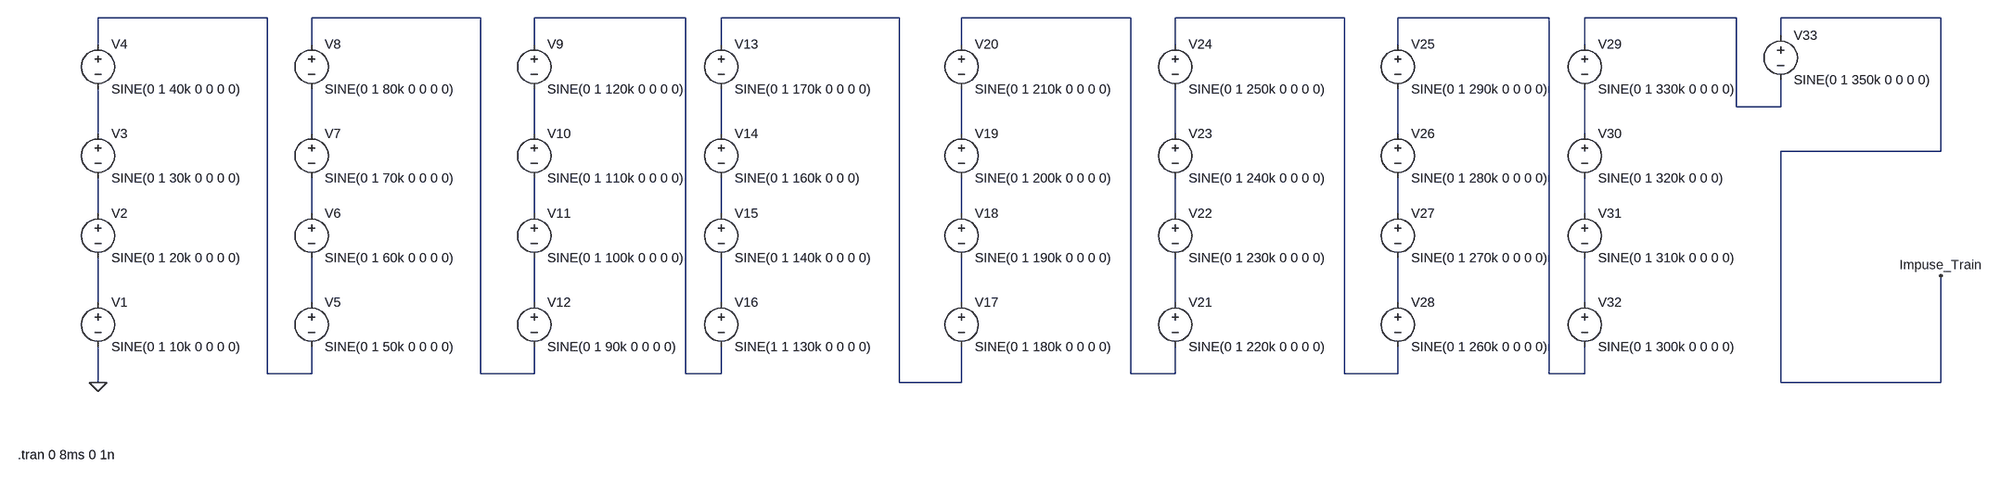
[diagram p0: schematic impuseIsgnals.asc]
impuseIsgnals.asc, the LTspice schematic file:
Version 4
SHEET 1 1928 680
WIRE -1184 -336 -1488 -336
WIRE -800 -336 -1104 -336
WIRE -432 -336 -704 -336
WIRE -48 -336 -368 -336
WIRE 368 -336 64 -336
WIRE 752 -336 448 -336
WIRE 1120 -336 848 -336
WIRE 1456 -336 1184 -336
WIRE 1824 -336 1536 -336
WIRE 1536 -304 1536 -336
WIRE -1488 -288 -1488 -336
WIRE -1104 -288 -1104 -336
WIRE -704 -288 -704 -336
WIRE -368 -288 -368 -336
WIRE 64 -288 64 -336
WIRE 448 -288 448 -336
WIRE 848 -288 848 -336
WIRE 1184 -288 1184 -336
WIRE 1456 -176 1456 -336
WIRE 1536 -176 1536 -224
WIRE 1536 -176 1456 -176
WIRE -1488 -128 -1488 -208
WIRE -1104 -128 -1104 -208
WIRE -704 -128 -704 -208
WIRE -368 -128 -368 -208
WIRE 64 -128 64 -208
WIRE 448 -128 448 -208
WIRE 848 -128 848 -208
WIRE 1184 -128 1184 -208
WIRE 1824 -96 1824 -336
WIRE 1824 -96 1536 -96
WIRE -1488 16 -1488 -48
WIRE -1104 16 -1104 -48
WIRE -704 16 -704 -48
WIRE -368 16 -368 -48
WIRE 64 16 64 -48
WIRE 448 16 448 -48
WIRE 848 16 848 -48
WIRE 1184 16 1184 -48
WIRE -1488 176 -1488 96
WIRE -1104 176 -1104 96
WIRE -704 176 -704 96
WIRE -368 176 -368 96
WIRE 64 176 64 96
WIRE 448 176 448 96
WIRE 848 176 848 96
WIRE 1184 176 1184 96
WIRE -1184 304 -1184 -336
WIRE -1104 304 -1104 256
WIRE -1104 304 -1184 304
WIRE -800 304 -800 -336
WIRE -704 304 -704 256
WIRE -704 304 -800 304
WIRE -432 304 -432 -336
WIRE -368 304 -368 256
WIRE -368 304 -432 304
WIRE 368 304 368 -336
WIRE 448 304 448 256
WIRE 448 304 368 304
WIRE 752 304 752 -336
WIRE 848 304 848 256
WIRE 848 304 752 304
WIRE 1120 304 1120 -336
WIRE 1184 304 1184 256
WIRE 1184 304 1120 304
WIRE -1488 320 -1488 256
WIRE -48 320 -48 -336
WIRE 64 320 64 256
WIRE 64 320 -48 320
WIRE 1536 320 1536 -96
WIRE 1824 320 1824 128
WIRE 1824 320 1536 320
FLAG -1488 320 0
FLAG 1824 128 Impuse_Train
SYMBOL voltage -1488 160 R0
WINDOW 123 0 0 Left 2
WINDOW 39 0 0 Left 2
SYMATTR InstName V1
SYMATTR Value SINE(0 1 10k 0 0 0 0)
SYMBOL voltage -1488 0 R0
WINDOW 123 0 0 Left 2
WINDOW 39 0 0 Left 2
SYMATTR InstName V2
SYMATTR Value SINE(0 1 20k 0 0 0 0)
SYMBOL voltage -1488 -144 R0
WINDOW 123 0 0 Left 2
WINDOW 39 0 0 Left 2
SYMATTR InstName V3
SYMATTR Value SINE(0 1 30k 0 0 0 0)
SYMBOL voltage -1488 -304 R0
WINDOW 123 0 0 Left 2
WINDOW 39 0 0 Left 2
SYMATTR InstName V4
SYMATTR Value SINE(0 1 40k 0 0 0 0)
SYMBOL voltage -1104 160 R0
WINDOW 123 0 0 Left 2
WINDOW 39 0 0 Left 2
SYMATTR InstName V5
SYMATTR Value SINE(0 1 50k 0 0 0 0)
SYMBOL voltage -1104 0 R0
WINDOW 123 0 0 Left 2
WINDOW 39 0 0 Left 2
SYMATTR InstName V6
SYMATTR Value SINE(0 1 60k 0 0 0 0)
SYMBOL voltage -1104 -144 R0
WINDOW 123 0 0 Left 2
WINDOW 39 0 0 Left 2
SYMATTR InstName V7
SYMATTR Value SINE(0 1 70k 0 0 0 0)
SYMBOL voltage -1104 -304 R0
WINDOW 123 0 0 Left 2
WINDOW 39 0 0 Left 2
SYMATTR InstName V8
SYMATTR Value SINE(0 1 80k 0 0 0 0)
SYMBOL voltage -704 -304 R0
WINDOW 123 0 0 Left 2
WINDOW 39 0 0 Left 2
SYMATTR InstName V9
SYMATTR Value SINE(0 1 120k 0 0 0 0)
SYMBOL voltage -704 -144 R0
WINDOW 123 0 0 Left 2
WINDOW 39 0 0 Left 2
SYMATTR InstName V10
SYMATTR Value SINE(0 1 110k 0 0 0 0)
SYMBOL voltage -704 0 R0
WINDOW 123 0 0 Left 2
WINDOW 39 0 0 Left 2
SYMATTR InstName V11
SYMATTR Value SINE(0 1 100k 0 0 0 0)
SYMBOL voltage -704 160 R0
WINDOW 123 0 0 Left 2
WINDOW 39 0 0 Left 2
SYMATTR InstName V12
SYMATTR Value SINE(0 1 90k 0 0 0 0)
SYMBOL voltage -368 -304 R0
WINDOW 123 0 0 Left 2
WINDOW 39 0 0 Left 2
SYMATTR InstName V13
SYMATTR Value SINE(0 1 170k 0 0 0 0)
SYMBOL voltage -368 -144 R0
WINDOW 123 0 0 Left 2
WINDOW 39 0 0 Left 2
SYMATTR InstName V14
SYMATTR Value SINE(0 1 160k 0 0 0)
SYMBOL voltage -368 0 R0
WINDOW 123 0 0 Left 2
WINDOW 39 0 0 Left 2
SYMATTR InstName V15
SYMATTR Value SINE(0 1 140k 0 0 0 0)
SYMBOL voltage -368 160 R0
WINDOW 123 0 0 Left 2
WINDOW 39 0 0 Left 2
SYMATTR InstName V16
SYMATTR Value SINE(1 1 130k 0 0 0 0)
SYMBOL voltage 64 160 R0
WINDOW 123 0 0 Left 2
WINDOW 39 0 0 Left 2
SYMATTR InstName V17
SYMATTR Value SINE(0 1 180k 0 0 0 0)
SYMBOL voltage 64 0 R0
WINDOW 123 0 0 Left 2
WINDOW 39 0 0 Left 2
SYMATTR InstName V18
SYMATTR Value SINE(0 1 190k 0 0 0 0)
SYMBOL voltage 64 -144 R0
WINDOW 123 0 0 Left 2
WINDOW 39 0 0 Left 2
SYMATTR InstName V19
SYMATTR Value SINE(0 1 200k 0 0 0 0)
SYMBOL voltage 64 -304 R0
WINDOW 123 0 0 Left 2
WINDOW 39 0 0 Left 2
SYMATTR InstName V20
SYMATTR Value SINE(0 1 210k 0 0 0 0)
SYMBOL voltage 448 160 R0
WINDOW 123 0 0 Left 2
WINDOW 39 0 0 Left 2
SYMATTR InstName V21
SYMATTR Value SINE(0 1 220k 0 0 0 0)
SYMBOL voltage 448 0 R0
WINDOW 123 0 0 Left 2
WINDOW 39 0 0 Left 2
SYMATTR InstName V22
SYMATTR Value SINE(0 1 230k 0 0 0 0)
SYMBOL voltage 448 -144 R0
WINDOW 123 0 0 Left 2
WINDOW 39 0 0 Left 2
SYMATTR InstName V23
SYMATTR Value SINE(0 1 240k 0 0 0 0)
SYMBOL voltage 448 -304 R0
WINDOW 123 0 0 Left 2
WINDOW 39 0 0 Left 2
SYMATTR InstName V24
SYMATTR Value SINE(0 1 250k 0 0 0 0)
SYMBOL voltage 848 -304 R0
WINDOW 123 0 0 Left 2
WINDOW 39 0 0 Left 2
SYMATTR InstName V25
SYMATTR Value SINE(0 1 290k 0 0 0 0)
SYMBOL voltage 848 -144 R0
WINDOW 123 0 0 Left 2
WINDOW 39 0 0 Left 2
SYMATTR InstName V26
SYMATTR Value SINE(0 1 280k 0 0 0 0)
SYMBOL voltage 848 0 R0
WINDOW 123 0 0 Left 2
WINDOW 39 0 0 Left 2
SYMATTR InstName V27
SYMATTR Value SINE(0 1 270k 0 0 0 0)
SYMBOL voltage 848 160 R0
WINDOW 123 0 0 Left 2
WINDOW 39 0 0 Left 2
SYMATTR InstName V28
SYMATTR Value SINE(0 1 260k 0 0 0 0)
SYMBOL voltage 1184 -304 R0
WINDOW 123 0 0 Left 2
WINDOW 39 0 0 Left 2
SYMATTR InstName V29
SYMATTR Value SINE(0 1 330k 0 0 0 0)
SYMBOL voltage 1184 -144 R0
WINDOW 123 0 0 Left 2
WINDOW 39 0 0 Left 2
SYMATTR InstName V30
SYMATTR Value SINE(0 1 320k 0 0 0)
SYMBOL voltage 1184 0 R0
WINDOW 123 0 0 Left 2
WINDOW 39 0 0 Left 2
SYMATTR InstName V31
SYMATTR Value SINE(0 1 310k 0 0 0 0)
SYMBOL voltage 1184 160 R0
WINDOW 123 0 0 Left 2
WINDOW 39 0 0 Left 2
SYMATTR InstName V32
SYMATTR Value SINE(0 1 300k 0 0 0 0)
SYMBOL voltage 1536 -320 R0
WINDOW 123 0 0 Left 2
WINDOW 39 0 0 Left 2
SYMATTR InstName V33
SYMATTR Value SINE(0 1 350k 0 0 0 0)
TEXT -1632 488 Left 2 !.tran 0 8ms 0 1n

The netlist it stands for:
* impuseIsgnals.asc
V1 N025 0 SINE(0 1 10k 0 0 0 0)
V2 N017 N025 SINE(0 1 20k 0 0 0 0)
V3 N009 N017 SINE(0 1 30k 0 0 0 0)
V4 N001 N009 SINE(0 1 40k 0 0 0 0)
V5 N026 N001 SINE(0 1 50k 0 0 0 0)
V6 N018 N026 SINE(0 1 60k 0 0 0 0)
V7 N010 N018 SINE(0 1 70k 0 0 0 0)
V8 N002 N010 SINE(0 1 80k 0 0 0 0)
V9 N003 N011 SINE(0 1 120k 0 0 0 0)
V10 N011 N019 SINE(0 1 110k 0 0 0 0)
V11 N019 N027 SINE(0 1 100k 0 0 0 0)
V12 N027 N002 SINE(0 1 90k 0 0 0 0)
V13 N004 N012 SINE(0 1 170k 0 0 0 0)
V14 N012 N020 SINE(0 1 160k 0 0 0)
V15 N020 N028 SINE(0 1 140k 0 0 0 0)
V16 N028 N003 SINE(1 1 130k 0 0 0 0)
V17 N029 N004 SINE(0 1 180k 0 0 0 0)
V18 N021 N029 SINE(0 1 190k 0 0 0 0)
V19 N013 N021 SINE(0 1 200k 0 0 0 0)
V20 N005 N013 SINE(0 1 210k 0 0 0 0)
V21 N030 N005 SINE(0 1 220k 0 0 0 0)
V22 N022 N030 SINE(0 1 230k 0 0 0 0)
V23 N014 N022 SINE(0 1 240k 0 0 0 0)
V24 N006 N014 SINE(0 1 250k 0 0 0 0)
V25 N007 N015 SINE(0 1 290k 0 0 0 0)
V26 N015 N023 SINE(0 1 280k 0 0 0 0)
V27 N023 N031 SINE(0 1 270k 0 0 0 0)
V28 N031 N006 SINE(0 1 260k 0 0 0 0)
V29 N008 N016 SINE(0 1 330k 0 0 0 0)
V30 N016 N024 SINE(0 1 320k 0 0 0)
V31 N024 N032 SINE(0 1 310k 0 0 0 0)
V32 N032 N007 SINE(0 1 300k 0 0 0 0)
V33 Impuse_Train N008 SINE(0 1 350k 0 0 0 0)
.tran 0 8ms 0 1n
.backanno
.end